# EAGLE schematic bare minimum (EAGLE 6.6.0)
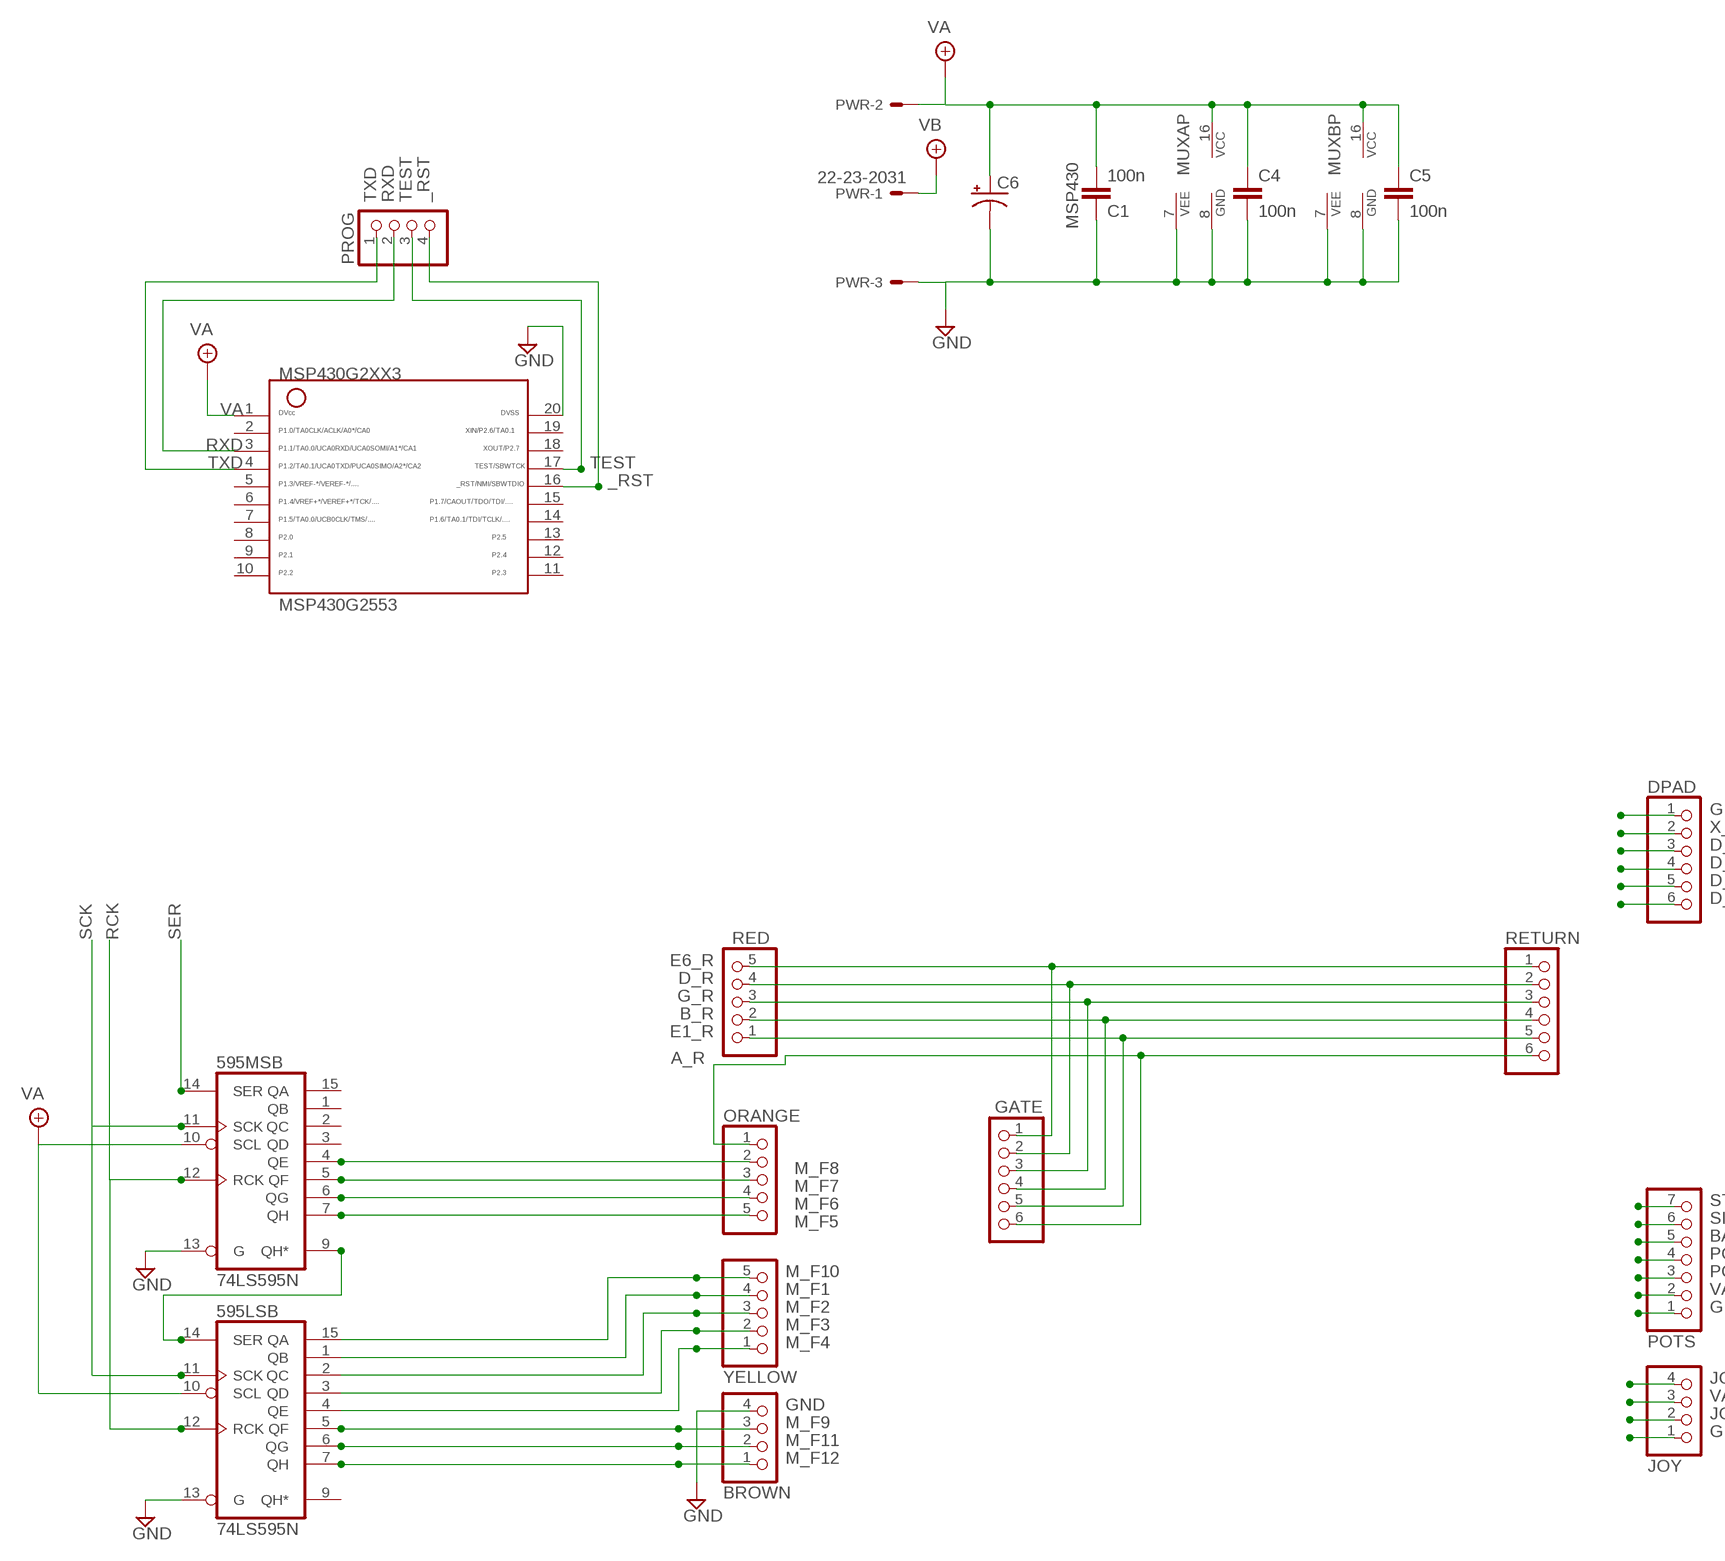
[diagram p0: schematic, sheet 1, part 1 of 2]
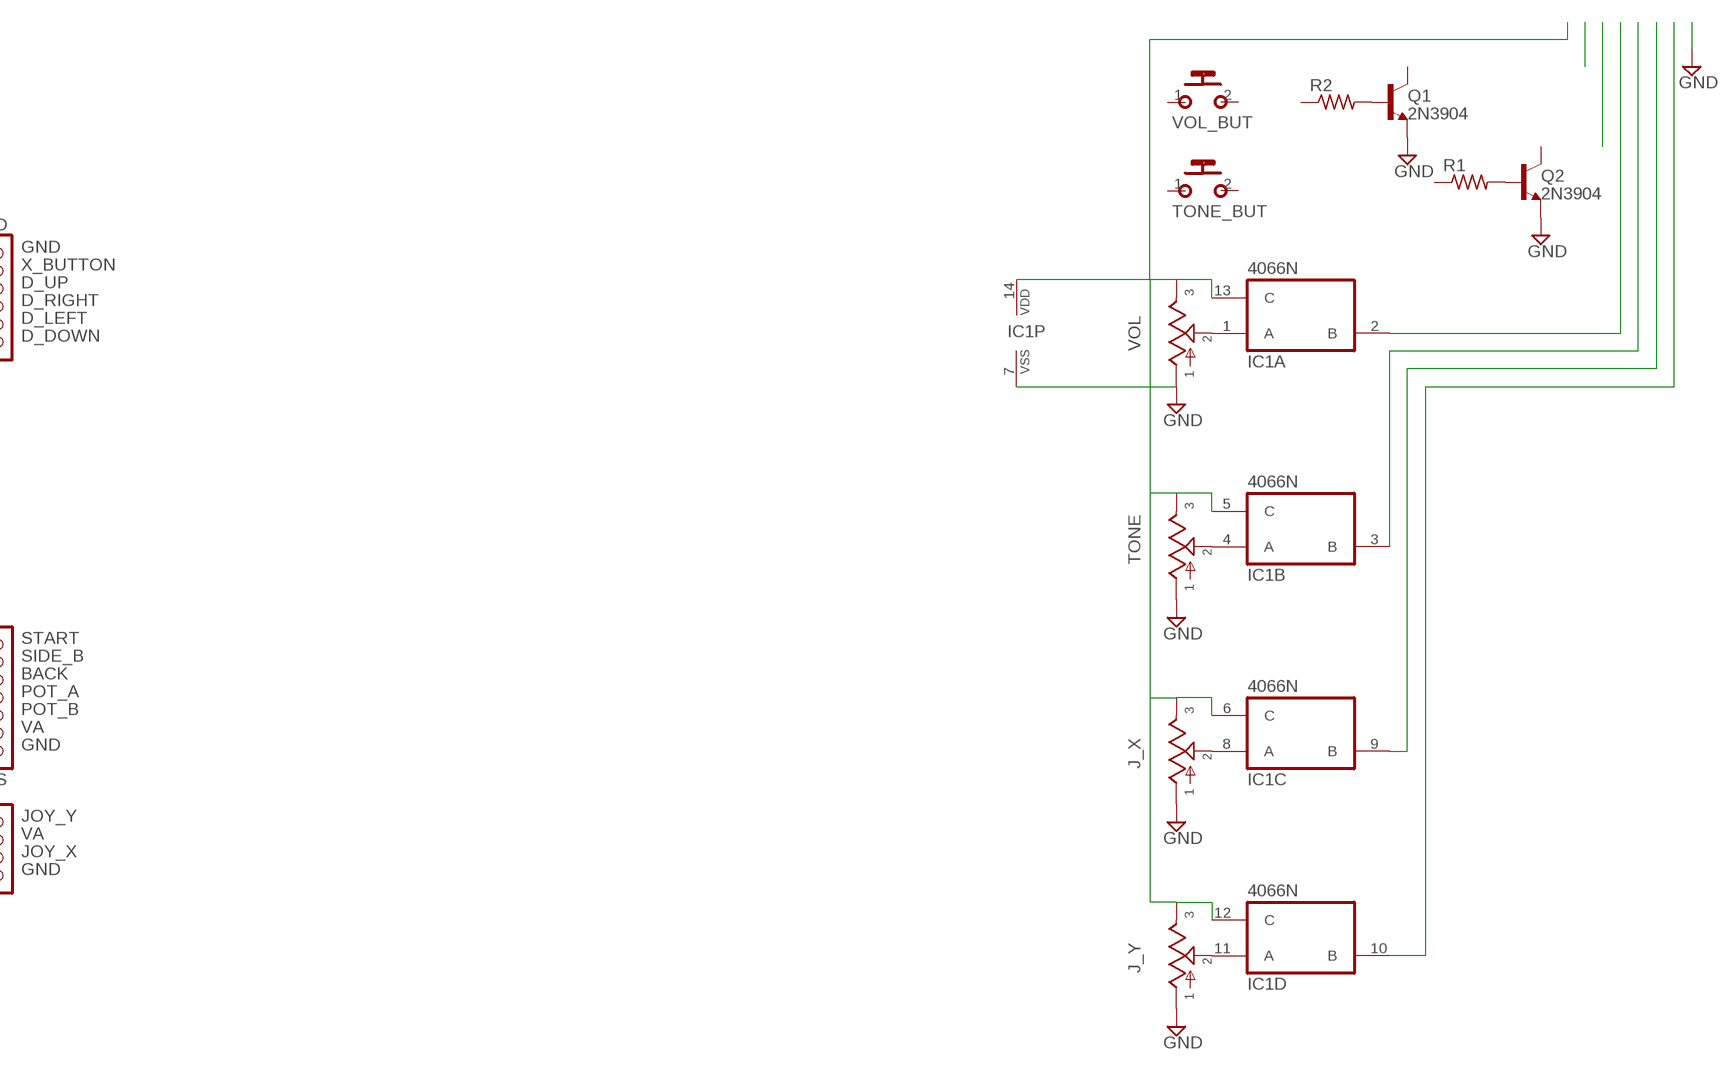
[diagram p1: schematic, sheet 1, part 2 of 2]

## Parts
595LSB  74LS595N  [DIL16]
595MSB  74LS595N  [DIL16]
BROWN  PINHD-1X4  [1X04]
C1  100n  050X030_050  [050X030_050_3]
C4  100n  050X030_0501  [050X030_050_1]
C5  100n  050X030_050  [050X030_050_3]
C6  0501  [050_020_1]
DPAD  PINHD-1X6  [1X06]
GATE  PINHD-1X6  [1X06]
IC1  4066N  [DIL14]
J_X  POT16MM  [16MM]
J_Y  POT16MM  [16MM]
JOY  PINHD-1X4  [1X04]
MSP430G2553  G2XX3---N20  [N20]
MUXA  4051N  [DIL16]
MUXB  4052N  [DIL16]
ORANGE  PINHD-1X5  [1X05]
POTS  PINHD-1X7  [1X07]
PROG  PINHD-1X4  [1X04]
PWR  22-23-2031  [22-23-2031]
Q1  2N3904  [TO92-]
Q2  2N3904  [TO92-]
R1  6MM.3  [R0207/3]
R2  6MM.3  [R0207/3]
RED  PINHD-1X5  [1X05]
RETURN  PINHD-1X6  [1X06]
TONE  POT16MM  [16MM]
TONE_BUT  MOMENTARY  [SPST2]
VOL  POT16MM  [16MM]
VOL_BUT  MOMENTARY  [SPST2]
YELLOW  PINHD-1X5  [1X05]

## Nets
_RST: MSP430G2553.16 PROG.4
A_R: GATE.6 ORANGE.1 RETURN.6
B_R: GATE.4 RED.2 RETURN.4
BACK: POTS.7
D_DOWN: DPAD.6
D_LEFT: DPAD.5
D_R: GATE.2 RED.4 RETURN.2
D_RIGHT: DPAD.4
D_UP: DPAD.3
E1_R: GATE.5 RED.1 RETURN.5
E6_R: GATE.1 RED.5 RETURN.1
G_R: GATE.3 RED.3 RETURN.3
GND: 595LSB.13(G) 595MSB.13(G) BROWN.4 C1.1 C4.2 C5.2 C6.- DPAD.1 IC1.7(P:VSS) J_X.1 J_Y.1 JOY.1 MSP430G2553.20 MUXA.7(VEE) MUXA.8(GND) MUXB.7(VEE) MUXB.8(GND) POTS.1 PWR.3 Q1.3(E) Q2.3(E) TONE.1 VOL.1
JOY_X: JOY.2
JOY_Y: JOY.4
M_F1: 595LSB.1(QB) YELLOW.4
M_F2: 595LSB.2(QC) YELLOW.3
M_F3: 595LSB.3(QD) YELLOW.2
M_F4: 595LSB.4(QE) YELLOW.1
M_F5: 595MSB.7(QH) ORANGE.5
M_F6: 595MSB.6(QG) ORANGE.4
M_F7: 595MSB.5(QF) ORANGE.3
M_F8: 595MSB.4(QE) ORANGE.2
M_F9: 595LSB.5(QF) BROWN.3
M_F10: 595LSB.15(QA) YELLOW.5
M_F11: 595LSB.6(QG) BROWN.2
M_F12: 595LSB.7(QH) BROWN.1
N$1: 595LSB.14(SER) 595MSB.9(QH*)
N$2: IC1.1(A:A) VOL.2
N$3: IC1.4(B:A) TONE.2
N$4: IC1.8(C:A) J_X.2
N$5: IC1.11(D:A) J_Y.2
N$6: IC1.2(A:B)
N$7: IC1.3(B:B)
N$8: IC1.9(C:B)
N$9: IC1.5(B:C) IC1.6(C:C) IC1.12(D:C) IC1.13(A:C) IC1.14(P:VDD) J_X.3 J_Y.3 TONE.3 VOL.3
N$10: IC1.10(D:B)
N$11: Q1.2(B) R2.2
N$12: Q2.2(B) R1.2
POT_A: POTS.4
POT_B: POTS.3
RCK: 595LSB.12(RCK) 595MSB.12(RCK)
RXD: MSP430G2553.3 PROG.2
SCK: 595LSB.11(SCK) 595MSB.11(SCK)
SER: 595MSB.14(SER)
SIDE_B: POTS.6
START: POTS.5
TEST: MSP430G2553.17 PROG.3
TXD: MSP430G2553.4 PROG.1
VA: 595LSB.10(SCL) 595MSB.10(SCL) C1.2 C4.1 C5.1 C6.+ JOY.3 MSP430G2553.1 MUXA.16(VCC) MUXB.16(VCC) POTS.2 PWR.2
VB: PWR.1
X_BUTTON: DPAD.2
Unconnected: 595LSB.9(QH*) 595MSB.1(QB) 595MSB.2(QC) 595MSB.3(QD) 595MSB.15(QA) MSP430G2553.2 MSP430G2553.5 MSP430G2553.6 MSP430G2553.7 MSP430G2553.8 MSP430G2553.9 MSP430G2553.10 MSP430G2553.11 MSP430G2553.12 MSP430G2553.13 MSP430G2553.14 MSP430G2553.15 MSP430G2553.18 MSP430G2553.19 MUXA.1(X4) MUXA.2(X6) MUXA.3(X) MUXA.4(X7) MUXA.5(X5) MUXA.6(INH) MUXA.9(C) MUXA.10(B) MUXA.11(A) MUXA.12(X3) MUXA.13(X0) MUXA.14(X1) MUXA.15(X2) MUXB.1(Y0) MUXB.2(Y2) MUXB.3(Y) MUXB.4(Y3) MUXB.5(Y1) MUXB.6(INH) MUXB.9(B) MUXB.10(A) MUXB.11(X3) MUXB.12(X0) MUXB.13(X) MUXB.14(X1) MUXB.15(X2) Q1.1(C) Q2.1(C) R1.1 R2.1 TONE_BUT.1(P) TONE_BUT.2(S) VOL_BUT.1(P) VOL_BUT.2(S)

## Notes on the sheet
- MSP430

## Power pins joined to a net without a drawn wire
GND: 595LSB.8(GND) 595MSB.8(GND)
VCC: 595LSB.16(VCC) 595MSB.16(VCC)

## Library data of the parts
595LSB 595MSB = 74xx-us:74*595: 8-bit SHIFT REGISTER, output latch
BROWN JOY PROG = pinhead:PINHD-1X4: PIN HEADER
C1 C4 C5 = gm-caps-ceramic:050X030_050: 120 - 150pF Xicon Ceramic Disc 5mm lead spacing
C6 = gm-caps-electro-pol:050: 0.22 - 100uF Xicon values at Mouser.com: 10V: 10 - 100uF; 16V: 2.2 - 47uF; 25V: 0.47 - 47uF; 50V: 0.22 - 22uF
DPAD GATE RETURN = pinhead:PINHD-1X6: PIN HEADER
IC1 = 40xx:4066: Quad bilateral ANALOG SWITCH
J_X J_Y TONE VOL = gm-pots:POT: Potentiometers the arrow indicates the clockwise motion of th wiper (lug 2) fully counter clockwise there is no resistance between lugs 1 and 2 fully clockwise the resistance between lugs 1 and 2 is the value of the pot
MSP430G2553 = TI_MSP430_v16:G2XX3---N20: MSP430G2XX1 PDIP (N) 20 Pin Package
MUXA = 40xx:4051: 8-channel ANALOG MULTIPLEXER
MUXB = 40xx:4052: Dual 4-channel ANALOG MULTIPLEXER
ORANGE RED YELLOW = pinhead:PINHD-1X5: PIN HEADER
POTS = pinhead:PINHD-1X7: PIN HEADER
PWR = jaapie:22-23-2031: .100" (2.54mm) Center Header - 3 Pin; MF: MOLEX; MPN: 22-23-2031; OC_FARNELL: 1462950; OC_NEWARK: 30C0862
Q1 Q2 = gm-trans:2N3904: NPN Transistor
R1 R2 = gm-resistors:6MM: 6mm Resistors Leads spaced 1-6 holes apart for 0.1" perfboard. Suitable for 1/4 watt resistors.
TONE_BUT VOL_BUT = gm-switches:MOMENTARY